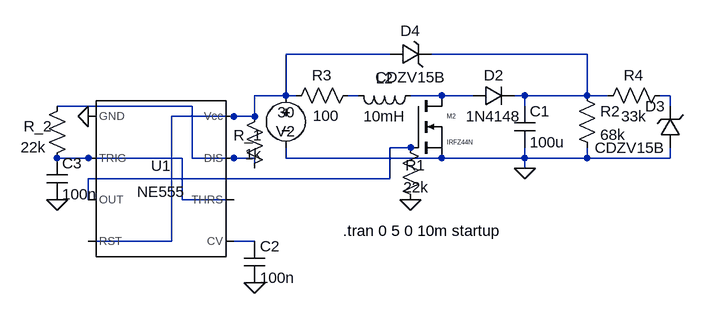
[diagram p0: schematic High_NMOS_Driver.asc]
High_NMOS_Driver.asc, the LTspice schematic file:
Version 4
SHEET 1 880 680
WIRE -144 -64 -304 -64
WIRE 160 -64 -80 -64
WIRE -304 0 -304 -64
WIRE -304 0 -352 0
WIRE -288 0 -304 0
WIRE -192 0 -208 0
WIRE -64 0 -112 0
WIRE -16 0 -64 0
WIRE 64 0 48 0
WIRE 160 0 160 -64
WIRE 160 0 64 0
WIRE 192 0 160 0
WIRE 288 0 272 0
WIRE -448 16 -656 16
WIRE 64 16 64 0
WIRE 288 16 288 0
WIRE -384 32 -480 32
WIRE -352 32 -352 0
WIRE -352 32 -384 32
WIRE -112 80 -144 80
WIRE -608 96 -656 96
WIRE -464 96 -608 96
WIRE -448 96 -448 16
WIRE -384 96 -448 96
WIRE -352 96 -384 96
WIRE -304 96 -304 80
WIRE -64 96 -304 96
WIRE 64 96 64 80
WIRE 64 96 -64 96
WIRE 160 96 160 80
WIRE 160 96 64 96
WIRE 288 96 288 80
WIRE 288 96 160 96
WIRE -352 112 -352 96
WIRE 64 112 64 96
WIRE -144 128 -144 80
WIRE -144 128 -608 128
WIRE -608 160 -608 128
WIRE -464 160 -464 96
WIRE -384 160 -464 160
WIRE -480 224 -480 32
WIRE -480 224 -608 224
WIRE -352 224 -384 224
FLAG 64 112 0
FLAG -112 160 0
FLAG -608 32 0
FLAG -352 288 0
FLAG -656 160 0
SYMBOL nmos -112 0 R0
WINDOW 0 56 32 Left 0
WINDOW 3 56 72 Left 0
SYMATTR InstName M2
SYMATTR Value IRFZ44N
SYMBOL res -128 64 R0
WINDOW 0 8 43 Left 2
WINDOW 3 5 77 Left 2
SYMATTR InstName R1
SYMATTR Value 22k
SYMBOL voltage -304 -16 R0
WINDOW 0 0 55 Top 2
WINDOW 3 1 57 Bottom 2
WINDOW 123 0 0 Left 0
WINDOW 39 0 0 Left 0
SYMATTR InstName V2
SYMATTR Value 30
SYMBOL cap 48 16 R0
SYMATTR InstName C1
SYMATTR Value 100u
SYMBOL res 144 -16 R0
SYMATTR InstName R2
SYMATTR Value 68k
SYMBOL diode -16 16 R270
WINDOW 0 32 32 VTop 2
WINDOW 3 0 32 VBottom 2
SYMATTR InstName D2
SYMATTR Value 1N4148
SYMBOL ind -96 -16 R90
WINDOW 0 5 56 VBottom 2
WINDOW 3 32 56 VTop 2
SYMATTR InstName L2
SYMATTR Value 10mH
SYMATTR SpiceLine Rser=1
SYMBOL res -192 -16 R90
WINDOW 0 0 56 VBottom 2
WINDOW 3 31 50 VTop 2
SYMATTR InstName R3
SYMATTR Value 100
SYMBOL Misc\\NE555 -496 128 R0
SYMATTR InstName U1
SYMBOL cap -368 224 R0
SYMATTR InstName C2
SYMATTR Value 100n
SYMBOL res -640 0 M0
WINDOW 0 23 47 Left 2
WINDOW 3 33 79 Left 2
SYMATTR InstName R_2
SYMATTR Value 22k
SYMBOL cap -672 96 R0
SYMATTR InstName C3
SYMATTR Value 100n
SYMBOL res -336 16 M0
WINDOW 0 4 45 Left 2
WINDOW 3 5 74 Left 2
SYMATTR InstName R_1
SYMATTR Value 1k
SYMBOL zener 304 80 R180
WINDOW 0 24 64 Left 2
WINDOW 3 24 0 Left 2
SYMATTR InstName D3
SYMATTR Value CDZV15B
SYMATTR Description Diode
SYMATTR Type diode
SYMBOL zener -144 -48 R270
WINDOW 0 36 32 VTop 2
WINDOW 3 -4 32 VBottom 2
SYMATTR InstName D4
SYMATTR Value CDZV15B
SYMATTR Description Diode
SYMATTR Type diode
SYMBOL res 288 -16 R90
WINDOW 0 0 56 VBottom 2
WINDOW 3 32 56 VTop 2
SYMATTR InstName R4
SYMATTR Value 33k
TEXT -216 208 Left 2 !.tran 0 5 0 10m startup

The netlist it stands for:
* High_NMOS_Driver.asc
M2 N004 N007 0 0 IRFZ44N
R1 N007 0 22k
V2 N001 0 30
C1 N002 0 100u
R2 N002 0 68k
D2 N004 N002 1N4148
L2 N004 N003 10mH Rser=1
R3 N003 N001 100
XU1 0 N008 N007 N001 N009 N008 N006 N001 NE555  ; pins GND TRIG OUT RST CV THRS DIS Vcc
C2 N009 0 100n
R_2 N006 N008 22k
C3 N008 0 100n
R_1 N001 N006 1k
D3 0 N005 CDZV15B
D4 N001 N002 CDZV15B
R4 N005 N002 33k
.model D D
.lib standard.dio
.model NMOS NMOS
.model PMOS PMOS
.lib standard.mos
.tran 0 5 0 10m startup
.lib NE555.sub
.backanno
.end